# EAGLE design RTU (EAGLE 9.2.2)
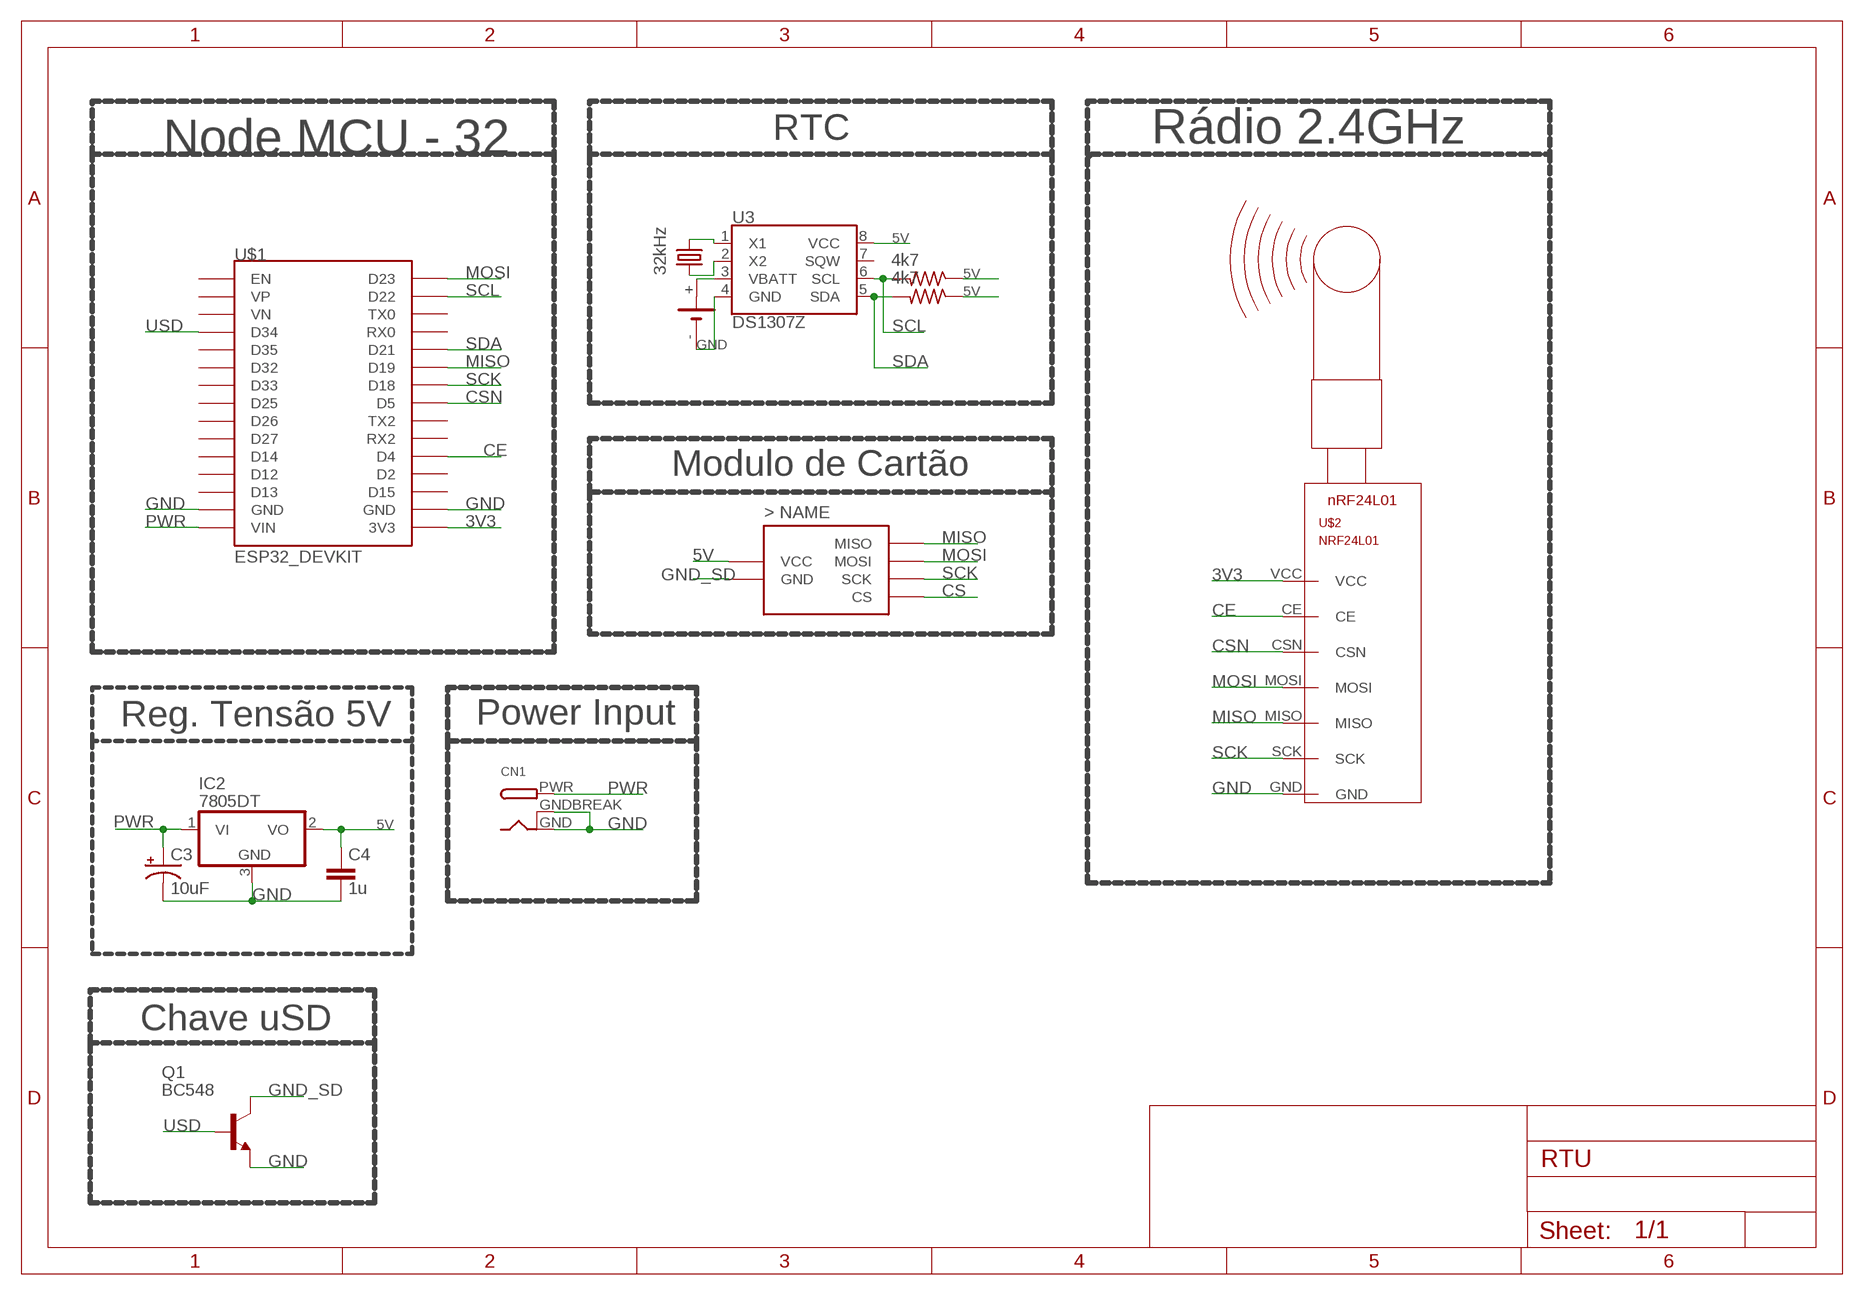
[diagram p0: schematic, sheet 1]

## Parts
C3  10uF  10UF-POLAR-RADIAL-2.5MM-25V-20%  [CPOL-RADIAL-2.5MM-5MM]
C4  1u  C-EU025-024X044  [C025-024X044]
CN1  DCBARRELPTH  [DCJACK_2MM_PTH]
G2  CH291-1220LF  [CH291-1220LF]
IC2  7805DT  [TO252]
Q1  BC548  [TO92-EBC]
R4  4k7  R-US_0204/7  [0204/7]
R5  4k7  R-US_0204/7  [0204/7]
U2  MICROSD_CATALEX  [MICROSD_CATALEX]
U3  DS1307Z  [SO08-0.15]
U$1  ESP32_DEVKIT  [ESP32_DEVKIT]
U$2  NRF24L01  [NRF24L01]
Y2  32kHz  CRYSTALTC38H  [TC38H]

## Nets
3V3: U$1.3V3 U$2.VCC
5V: C4.1 IC2.2(VO) R4.1 R5.1 U2.VCC U3.8(VCC)
CE: U$1.D4 U$2.CE
CS: U2.CS
CSN: U$1.D5 U$2.CSN
GND: C3.2(-) C4.2 CN1.GND CN1.GNDBREAK G2.- IC2.3(GND) Q1.E U3.4(GND) U$1.GND@1(GND) U$1.GND@2(GND) U$2.GND
GND_SD: Q1.C U2.GND
MISO: U2.MISO U$1.D19 U$2.MISO
MOSI: U2.MOSI U$1.D23 U$2.MOSI
N$1: U3.1(X1) Y2.2
N$2: U3.2(X2) Y2.1
N$3: G2.+ U3.3(VBATT)
PWR: C3.1(+) CN1.PWR IC2.1(VI) U$1.VIN
SCK: U2.SCK U$1.D18 U$2.SCK
SCL: R4.2 U3.6(SCL) U$1.D22
SDA: R5.2 U3.5(SDA) U$1.D21
USD: Q1.B U$1.D34
Unconnected: U3.7(SQW) U$1.D2 U$1.D12 U$1.D13 U$1.D14 U$1.D15 U$1.D25 U$1.D26 U$1.D27 U$1.D32 U$1.D33 U$1.D35 U$1.EN U$1.RX0 U$1.RX2 U$1.TX0 U$1.TX2 U$1.VN U$1.VP

## Notes on the sheet
- RTC | Rádio 2.4GHz
- Node MCU - 32
- Modulo de Cartão
- Reg. Tensão 5V | Power Input
- Chave uSD

## Library data of the parts
C3 = SparkFun-Capacitors:10UF-POLAR: 10.0µF polarized capacitors A capacitor is a passive two-terminal electrical component used to store electrical energy temporarily in an electric field.; PROD_ID: CAP-08440
C4 = resistor:C-EU: CAPACITOR, European symbol
CN1 = adafruit:DCBARREL: 2.0mm DC Barrel Jack DCJACK_2MM_PTH - Through Hole Jack (4UConnector: 05537)
G2 = battery:CH291-1220LF: Battery Holder, SMT, 12mm multicomp PART NO. CH291-1220LF Source: Data sheet <http://www.farnell.com/datasheets/1505860.pdf>
IC2 = linear:78*: Positive VOLTAGE REGULATOR Source: http://cache.national.com/ds/LM/LM78L05.pdf http://www.fairchildsemi.com/ds/LM/LM7805.pdf
Q1 = transistor-npn:BC548*: NPN Transistor
R4 R5 = adafruit:R-US_: RESISTOR, American symbol
U2 = wsc:MICROSD_CATALEX
U3 = SparkFun-Clocks:DS1307: Maxim DS1307 - I2C Real-time clock (RTC) The DS1307 serial real-time clock (RTC) is a low-power, full binary-coded decimal (BCD) clock/calendar plus 56 bytes of NV SRAM. Address and data are transferred serially through an I2C, bidirectional bus. The clock/calendar provides seconds, minutes, hours, day, date, month, and year information. SparkFun Products: Real Time Clock Module <https://www.sparkfun.com/products/12708> (BOB-12708) Datasheet <https://cdn.sparkfun.com/datasheets/BreakoutBoards/DS1307.pdf>; PROD_ID: IC-08138
U$1 = DOIT_ESP32_DEVKIT:ESP32_DEVKIT: ESP32 DEVKIT BOARD
U$2 = Clean-Kong:NRF24L01: nrF54L01 2.4GHz with 100 Channels Emitter/Reveiver SPI Controlled Roboshop / Minint
Y2 = SparkFun-FreqCtrl:CRYSTAL: Various standard crystals. Proven footprints.

## Net classes
0 default: width 0.4 mm, drill 0.6 mm, clearance 0.2 mm

## Board
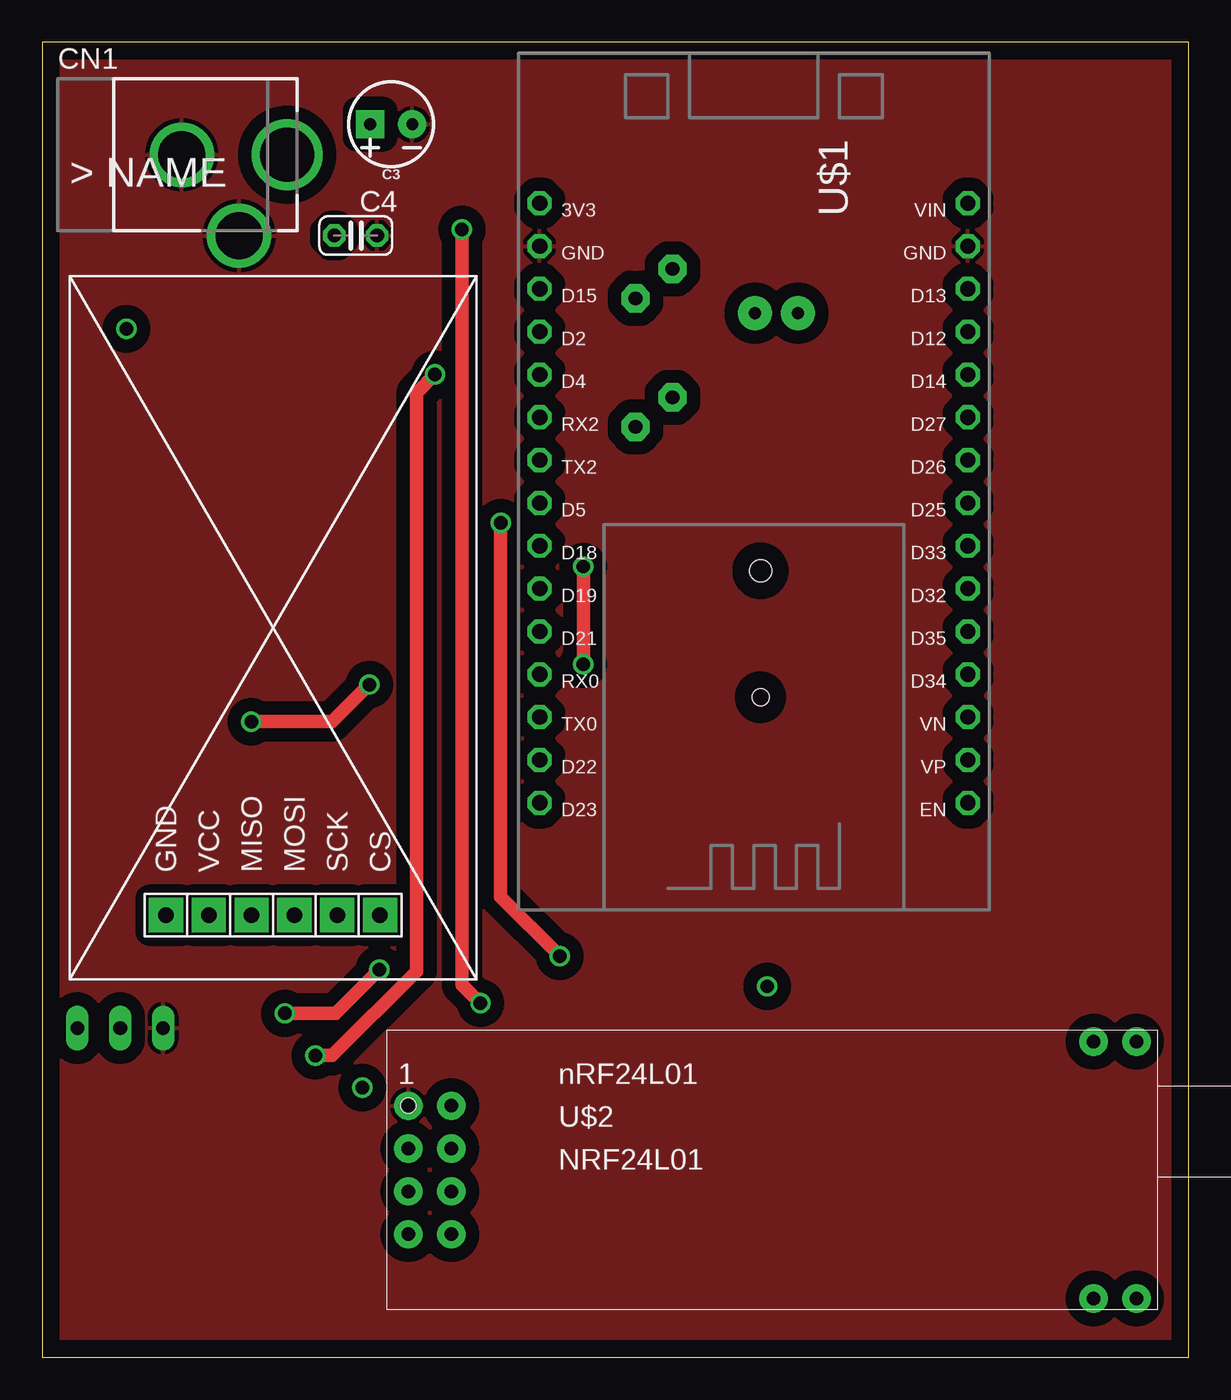
[diagram p1: board, top side]
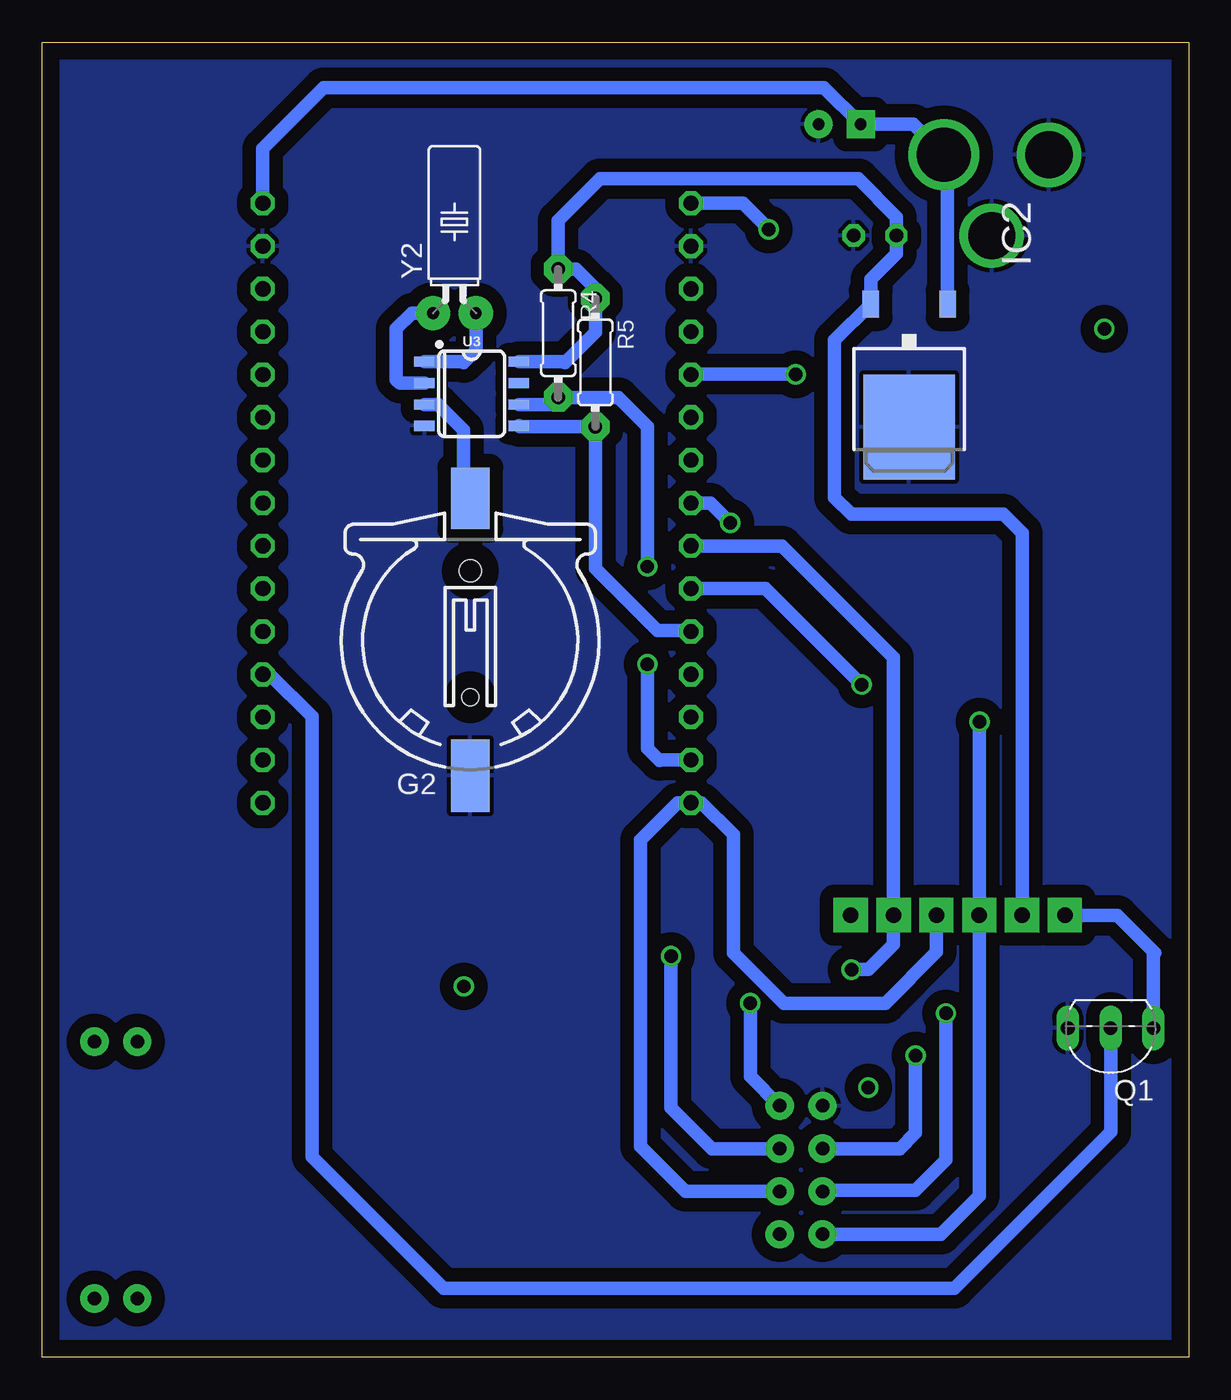
[diagram p2: board, bottom side, seen from below]

Size 68 x 78 mm. Coordinates in mm from the lower left corner, seen from the top.
Outline: 0,0 68,0 68,78 0,78 0,0
Copper layers (1*16): Top 0.035mm / dielectric 1.5mm / Bottom 0.035mm
Design rules "default": minimum track width 6mil, minimum drill 0.35mm, track to track 6mil, track to pad 6mil, pad to pad 6mil, via to via 6mil, smd to smd 6mil, copper to edge 40mil, drill to drill 6mil, minimum pad ring 10mil, minimum via ring 8mil, stop-mask expansion 4mil, vias tented up to drill 0mil, thermal gap 10mil

### Footprints (pad centres in the part's own frame; a part is rotated, then mirrored left to right if it is on the bottom)
CPOL-RADIAL-2.5MM-5MM = drill 0.7 pad 1.651 square: 1 1.25,0 | drill 0.7 pad 1.651: 2 -1.25,0
C025-024X044 = drill 0.813 octagon: 1 -1.27,0; 2 1.27,0
DCJACK_2MM_PTH = drill 2.8: GND 0,7.35; GNDBREAK 4.8,10.75 | drill 3.2: PWR 0,13.6
CH291-1220LF = smd 2.3 x 3.66: + 0,-2.296 | smd 2.3 x 4.3: - 0,14.146 | hole 1.3: 0,2 | hole 1: 0,9.5
TO252 = smd 1 x 1.6: 1 -2.28,-4.8; 2 2.28,-4.8 | smd 5.4 x 6.2: 3 0,2.5
TO92-EBC = drill 0.813 long: B 0,-1.27; C -2.54,-1.27; E 2.54,-1.27
0204/7 = drill 0.813 pad 1.676 octagon: 1 -3.81,0; 2 3.81,0
MICROSD_CATALEX = drill 0.914 pad 2.032 square: CS 18.35,3.95; GND 5.65,3.95; MISO 10.73,3.95; MOSI 13.27,3.95; SCK 15.81,3.95; VCC 8.19,3.95
SO08-0.15 = smd 0.6 x 1.2: 1 -1.905,-2.8; 2 -0.635,-2.8; 3 0.635,-2.8; 4 1.905,-2.8; 5 1.905,2.8; 6 0.635,2.8; 7 -0.635,2.8; 8 -1.905,2.8
ESP32_DEVKIT = drill 0.9 pad 1.422 octagon: 3V3 11.43,-17.78; D2 11.43,-10.16; D4 11.43,-7.62; D5 11.43,0; D12 -13.97,-10.16; D13 -13.97,-12.7; D14 -13.97,-7.62; D15 11.43,-12.7; D18 11.43,2.54; D19 11.43,5.08; D21 11.43,7.62; D22 11.43,15.24; D23 11.43,17.78; D25 -13.97,0; D26 -13.97,-2.54; D27 -13.97,-5.08; D32 -13.97,5.08; D33 -13.97,2.54; D34 -13.97,10.16; D35 -13.97,7.62; EN -13.97,17.78; GND@1 -13.97,-15.24; GND@2 11.43,-15.24; RX0 11.43,10.16; RX2 11.43,-5.08; TX0 11.43,12.7; TX2 11.43,-2.54; VIN -13.97,-17.78; VN -13.97,12.7; VP -13.97,15.24
NRF24L01 = drill 0.8 pad 1.676: CE 0,-2.54; CSN 2.54,-2.54; GND 0,0; MISO 0,-7.62; MOSI 2.54,-5.08; P$1 40.64,-11.43; P$2 43.18,-11.43; P$3 43.18,3.81; P$4 40.64,3.81; P$8 2.54,-7.62; SCK 0,-5.08; VCC 2.54,0
TC38H = drill 0.711 pad 2.032: 1 -1.27,0; 2 1.27,0

### Placement (x,y rotation side)
C3  20.7,73.13 180 top
C4  18.6,66.53 0 top
CN1  0.93,71.32 270 top
G2  42.61,48.65 180 bottom
IC2  16.58,57.67 180 bottom
Q1  4.63,18.26 180 bottom
R4  37.39,60.74 270 bottom
R5  35.19,59 270 bottom
U2  1.69,22.27 0 top
U3  42.53,57.15 270 bottom
U$1  40.94,50.67 180 top
U$2  21.72,14.92 0 top
Y2  43.55,61.93 0 bottom

### Tracks (layer width: path | path; a pad name or v marks a point on that pad's centre or on a via)
3V3  (via drill 0.8)
  Top 0.813: v26,21 24.9,22.1 v24.9,66.9
  Bottom 0.813: U$2.VCC 26,16.66 v26,21 | v24.9,66.9 26.45,68.45 U$1.3V3
5V
  Bottom 0.813: U2.VCC 9.88,48.88 11,50 20,50 21,51 21,60.33 IC2.2 18.86,63.94 17.33,65.47 C4.1 17.33,67.63 19.6,69.9 34.9,69.9 37.39,67.41 R4.1 36.35,64.55 35.19,63.39 R5.1 35.19,60.81 37,59 37.05,59.05 U3.8
CE  (via drill 0.8)
  Top 0.813: v16.2,17.9 17.2,17.9 22.2,22.9 22.2,57.2 v23.3,58.3
  Bottom 0.813: U$2.CE 17.12,12.38 16.2,13.3 v16.2,17.9 | v23.3,58.3 U$1.D4
CSN  (via drill 0.8)
  Top 0.813: v30.7,23.8 27.2,27.3 v27.2,49.5
  Bottom 0.813: U$2.CSN 28.28,12.38 30.7,14.8 v30.7,23.8 | v27.2,49.5 28.37,50.67 U$1.D5
GND
  pour Top (isolate 0.8): 0,0 68,0 68,78 0,78
  pour Bottom (isolate 0.8): 0,0 68,0 68,78 0,78
GND_SD
  Bottom 0.813: U2.GND 4.22,26.22 2,24 2.09,23.91 Q1.C
MISO  (via drill 0.8)
  Top 0.813: v12.4,37.7 17.2,37.7 v19.4,39.9
  Bottom 0.813: v12.4,37.7 12.42,37.68 U2.MISO 12.42,9.58 14.7,7.3 U$2.MISO | v19.4,39.9 25.09,45.59 U$1.D19
MOSI
  Bottom 0.813: U2.MOSI 14.96,24.04 18,21 24,21 27,24 27,31 28.89,32.89 U$1.D23 30.31,32.89 32.51,30.69 32.51,12.51 29.84,9.84 U$2.MOSI
N$1
  Bottom 0.813: Y2.2 42.28,59.72 43,59 43.05,59.05 U3.1
N$2
  Bottom 0.813: Y2.1 46.07,61.93 47,61 47,58 46.78,57.78 U3.2
N$3
  Bottom 0.813: G2.+ 43,51.34 43,55 44.52,56.52 U3.3
N$4  (via drill 0.8)
  other vias: 43,22
N$5  (via drill 0.8)
  other vias: 19,16
N$6  (via drill 0.8)
  other vias: 5,61
PWR
  Bottom 0.813: U$1.VIN 54.91,71.69 51.3,75.3 21.62,75.3 C3.1 16.34,73.13 CN1.PWR 14.3,71.09 IC2.1
SCK  (via drill 0.8)
  Top 0.813: v14.4,20.4 17.4,20.4 v20,23
  Bottom 0.813: U$1.D18 24.13,48.13 17.5,41.5 U2.SCK 17.5,24.5 19,23 v20,23 | U$2.SCK 21.66,9.9 16.2,9.9 14.4,11.7 v14.4,20.4
SCL  (via drill 0.8)
  Top 0.813: v32.1,46.9 v32.1,41.1
  Bottom 0.813: U3.6 37.8,56.52 R4.2 33.83,56.93 32.1,55.2 v32.1,46.9 | v32.1,41.1 32.1,36.1 31.4,35.4 31.37,35.43 U$1.D22
SDA
  Bottom 0.813: U3.5 39.67,55.19 R5.2 35.19,46.79 31.5,43.1 29.56,43.1 U$1.D21
USD
  Bottom 0.813: Q1.B 4.63,13.37 13.9,4.1 44.2,4.1 52,11.9 52,38 54.51,40.51 U$1.D34